# Altium schematic sheet 50_Gestión_Alimentación.SchDoc
size A4; SheetNumber: 4; SheetTotal: 11
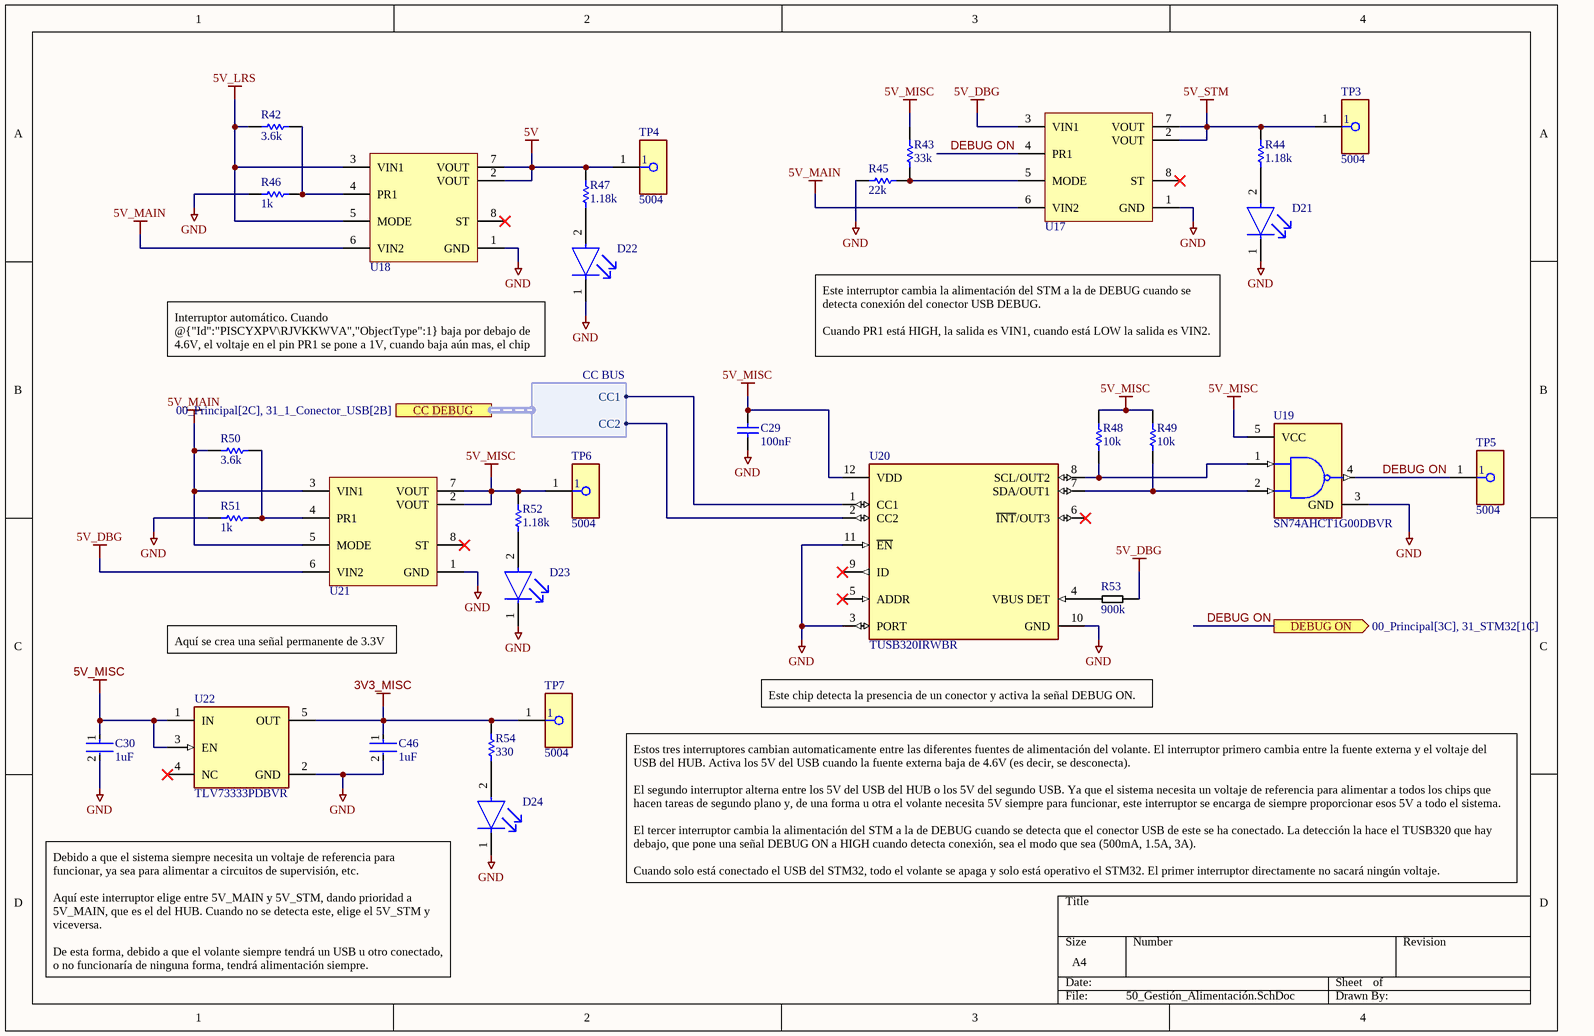
[diagram p0: 50_Gestión_Alimentación.SchDoc]

## Parts
C29  100nF  [CAPC1005X55X25NL05T05]
C30  1uF  [FP-C0402C-BB-IPC_B]
C46  1uF  [FP-C0402C-BB-IPC_B]
D21  APHD1608LZGCK  [FP-APHD1608LZGCK-MFG]  (value not drawn)
D22  APHD1608LZGCK  [FP-APHD1608LZGCK-MFG]  (value not drawn)
D23  APHD1608LZGCK  [FP-APHD1608LZGCK-MFG]  (value not drawn)
D24  APHD1608LZGCK  [FP-APHD1608LZGCK-MFG]  (value not drawn)
R42  3.6k  [RESC1005X40X25ML10T10]
R43  33k  [RESC1005X40X25NL10T10]
R44  1.18k  [RESC1005X40X25NL05T05]
R45  22k  [RESC1005X40X25NL10T10]
R46  1k  [RESC1005X40X25NL05T05]
R47  1.18k  [RESC1005X40X25NL05T05]
R48  10k  [RESC1005X40X25ML05T05]
R49  10k  [RESC1005X40X25ML05T05]
R50  3.6k  [RESC1005X40X25ML10T10]
R51  1k  [RESC1005X40X25NL05T05]
R52  1.18k  [RESC1005X40X25NL05T05]
R53  900k  [RES 1206]
R54  330  [RESC1005X40X25NL10T10]
TP3  5004  [FP-5004-MFG]
TP4  5004  [FP-5004-MFG]
TP5  5004  [FP-5004-MFG]
TP6  5004  [FP-5004-MFG]
TP7  5004  [FP-5004-MFG]
U17  TPS2117DRLR  [TPS2117DRLR]  (value not drawn)
U18  TPS2117DRLR  [TPS2117DRLR]  (value not drawn)
U19  SN74AHCT1G00DBVR  [FP-DBV0005A-IPC_A]
U20  TUSB320IRWBR  [FP-RWB0012A-MFG]
U21  TPS2117DRLR  [TPS2117DRLR]  (value not drawn)
U22  TLV73333PDBVR  [FP-DBV0005A-MFG]

## Ports
CC DEBUG (harness CC BUS, see 00_Principal[2C], 31_1_Conector_USB[2B]), DEBUG ON (out, see 00_Principal[3C], 31_STM32[1C])

## Harnesses
CC BUS: CC1, CC2

## Nets
3V3_MISC: C46.1 R54.2 TP7.1 U22.5(OUT)
5V: R47.2 TP4.1 U18.2(VOUT) U18.7(VOUT)
5V_DBG: R53.1 U17.3(VIN1) U21.6(VIN2)
5V_LRS: R42.1 U18.3(VIN1) U18.5(MODE)
5V_MAIN: R50.1 U17.6(VIN2) U18.6(VIN2) U21.3(VIN1) U21.5(MODE)
5V_MISC: C29.2 C30.1 R43.2 R48.2 R49.2 R52.2 TP6.1 U19.5(VCC) U20.12(VDD) U21.2(VOUT) U21.7(VOUT) U22.1(IN) U22.3(EN)
5V_STM: R44.2 TP3.1 U17.2(VOUT) U17.7(VOUT)
GND: C29.1 C30.2 C46.2 D21.1(C) D22.1(C) D23.1(C) D24.1(C) R45.1 R46.1 R51.1 U17.1(GND) U18.1(GND) U19.3(GND) U20.3(PORT) U20.10(GND) U20.11(~{EN}) U21.1(GND) U22.2(GND)
DEBUG ON: TP5.1 U17.4(PR1) U19.4(Y) ; port DEBUG ON
NetD21_2: D21.2(A) R44.1
NetD22_2: D22.2(A) R47.1
NetD23_2: D23.2(A) R52.1
NetD24_2: D24.2(A) R54.1
NetR42_2: R42.2 R46.2 U18.4(PR1)
NetR43_1: R43.1 R45.2 U17.5(MODE)
NetR48_1: R48.1 U19.1(A) U20.8(SCL/OUT2)
NetR49_1: R49.1 U19.2(B) U20.7(SDA/OUT1)
NetR50_2: R50.2 R51.2 U21.4(PR1)
NetR53_2: R53.2 U20.4(VBUS_DET)
NetU20_1: U20.1(CC1) ; port CC DEBUG.CC1
NetU20_2: U20.2(CC2) ; port CC DEBUG.CC2

Not connected (* = marked no-connect by the designer): U17 8(ST)*; U18 8(ST)*; U20 5(ADDR)* 6(~{INT}/OUT3)* 9(ID)*; U21 8(ST)*; U22 4(NC)*

## Notes on the sheet
- Interruptor automático. Cuando @{"Id":"PISCYXPV\RJVKKWVA","ObjectType":1} baja por debajo de 4.6V, el voltaje en el pin PR1 se pone a 1V, cuando baja aún mas, el chip cambia la salida a VIN2 y no usa 5V_LRS para ello.
- Este interruptor cambia la alimentación del STM a la de DEBUG cuando se detecta conexión del conector USB DEBUG.
  Cuando PR1 está HIGH, la salida es VIN1, cuando está LOW la salida es VIN2.
- Aquí se crea una señal permanente de 3.3V
- Este chip detecta la presencia de un conector y activa la señal DEBUG ON.
- Estos tres interruptores cambian automaticamente entre las diferentes fuentes de alimentación del volante. El interruptor primero cambia entre la fuente externa y el voltaje del USB del HUB. Activa los 5V del USB cuando la fuente externa baja de 4.6V (es decir, se desconecta).
  El segundo interruptor alterna entre los 5V del USB del HUB o los 5V del segundo USB. Ya que el sistema necesita un voltaje de referencia para alimentar a todos los chips que hacen tareas de segundo plano y, de una forma u otra el volante necesita 5V siempre para funcionar, este interruptor se encarga de siempre proporcionar esos 5V a todo el sistema.
  El tercer interruptor cambia la alimentación del STM a la de DEBUG cuando se detecta que el conector USB de este se ha conectado. La detección la hace el TUSB320 que hay debajo, que pone una señal DEBUG ON a HIGH cuando detecta conexión, sea el modo que sea (500mA, 1.5A, 3A).
  Cuando solo está conectado el USB del STM32, todo el volante se apaga y solo está operativo el STM32. El primer interruptor directamente no sacará ningún voltaje.
- Debido a que el sistema siempre necesita un voltaje de referencia para funcionar, ya sea para alimentar a circuitos de supervisión, etc.
  Aquí este interruptor elige entre 5V_MAIN y 5V_STM, dando prioridad a 5V_MAIN, que es el del HUB. Cuando no se detecta este, elige el 5V_STM y viceversa.
  De esta forma, debido a que el volante siempre tendrá un USB u otro conectado, o no funcionaría de ninguna forma, tendrá alimentación siempre.

## Library data of the parts
C29 = CMP-2008-02030-1: Manufacturer: Vitramon; Part Number: VJ0402Y104KXJCW1BC
C30 C46 = CMP-03020-034679-1: CAP CER 1UF 16V X5R 0402; Dielectric Material: Ceramic; Tolerance: 10%; RoHS Compliant: Yes; Voltage Rating (DC): 16V; Voltage Rating: 16V; Max Operating Temperature: 85°C; Packaging: Cut Tape; Width: 0.02inch; Dielectric: X5R; Lead Free: Lead Free; Min Operating Temperature: -55°C; Mount: Surface Mount; Case/Package: 0402; Thickness: 0.022inch; REACH SVHC: No SVHC; Length: 0.039inch; Case Code (Metric): 1005; Case Code (Imperial): 0402; Capacitance: 1uF
D21-D24 = CMP-44529-000045-1: LED GREEN CLEAR 1608 SMD; Test Current: 2mA; Dominant Wavelength: 525nm; Lens Color: Colorless; Luminous Intensity: 180mcd; Viewing Angle: 100°; Forward Voltage: 2.65V; Lens Size: 0.7mm; Lens Style: Round; Mount: Surface Mount; Packaging: Tape and Reel; Lens Transparency: Clear; Height: 0.75mm; Case/Package: 0603; Length: 1.6mm; Case Code (Metric): 1608; Width: 0.8mm; Color: Green; Case Code (Imperial): 0603
R42 R50 = CMP-2002-05802-1: Manufacturer: Panasonic; Part Number: ERA-2AEB362X
R43 = CMP-2002-05855-1: Part Number: ERA-2AED333X; Manufacturer: Panasonic
R44 R47 R52 = CMP-1011-00517-2: Part Number: ERJ-2RKF1181X; Manufacturer: Panasonic
R45 = CMP-2002-05849-1: Manufacturer: Panasonic; Part Number: ERA-2AED223X
R46 R51 = CMP-1011-00510-4: Chip Resistor, 1 KOhm, +/- 1%, 100 mW, -55 to 155 degC, 0402 (1005 Metric), RoHS, Tape and Reel; PartNumber: ERJ-2RKF1001X; Manufacturer: Basic Passives; Voltage Rating: 50 V; Case\/Package: 0402; Resistance: 1 KOhm; Power Rating: 100 mW; DatasheetVersion: 04/2015; Radiation Hardening: No; Pins: 2; Height: 0.35 mm; RoHSCompliant: true; Case Code (Imperial): 0402; ComponentLink2Description: Datasheet; ComponentLink1Description: Manufacturer URL; PackageReference: 0402; Mount: Surface Mount; Package Quantity: 10000; Tolerance: 1%; ComponentLink1URL: http://www.panasonic.com/; PackageDescription: 2-Pin Surface Mount Device, Body 1 x 0.5 mm; Mounting Technology: Surface Mount; Case Code (Metric): 1005; ComponentLink2URL: http://industrial.panasonic.com/cdbs/www-data/pdf/RDA0000/AOA0000C86.pdf; REACH SVHC: Yes; Packaging: Tape and Reel; Max Operating Temperature: 155 degC; Min Operating Temperature: -55 degC; Width: 0.5 mm; Length: 1 mm
R48 R49 = CMP-2002-00601-1: Manufacturer: Panasonic; Part Number: ERJ-2RHD1002X
R53 = RT1206CRE07900KL: 900k Resistor 200V 1206 0.5%; Supplier 1: DigiKey; Supplier Part Number 1: 13-RT1206CRE07900KLCT-ND
R54 = CMP-2002-05883-1: Manufacturer: Panasonic; Part Number: ERA2AEB331X
TP3-TP7 = CMP-2000-05575-2: PC TEST POINT MINIATURE YELLOW; Manufacturer: Keystone; Number Of Contacts: 1; Is Female: yes; Device Class L1: Connectors; Manufacturer Part Number: 5004; Digikey Description: PC TEST POINT MINIATURE YELLOW; ComponentLink2URL: https://www.keyelco.com/product-pdf.cfm?p=1313; Lead Free: Yes; ComponentLink2Description: Datasheet; Category: Conn; Height: 4.72mm; Octopart: https://octopart.com/5004-keystone-28591; Mouser Description: TEST POINT PC MINI .040"D YELLOW; Device Class L3: unset; Contact Material: Silver; Package: 5004; Automotive: No; Device Class L2: unset; RoHS: TRUE
U17 U18 U21 = TPS2117DRLR: Power Switch ICs - Power Distribution 1.6-V to 5.5-V 20-m ? 4-A low IQ power; Supplier 1: DigiKey; Supplier Part Number 1: 296-TPS2117DRLRCT-ND
U19 = CMP-0859-00141-4: IC GATE NAND 1CH 2-INP SOT23-5; Output Current: 8mA; Max Supply Voltage: 5.5V; High Level Output Current: -8mA; Number of Circuits: 1; Schmitt Trigger Input: No; Propagation Delay: 7.9ns; Logic Function: NAND GATE; Min Supply Voltage: 4.5V; Number of Input Lines: 2; Turn-On Delay Time: 9ns; Quiescent Current: 1uA; Length: 2.9mm; Number of Pins: 5; Lead Free: Lead Free; Height: 1.15mm; Case/Package: SOT-23; Termination: SMD/SMT; Packaging: Tape and Reel; Number of Bits: 1; Number of Elements: 1; REACH SVHC: No SVHC; Low Level Output Current: 8mA; Number of Output Lines: 1; Weight: 0.000557oz; Mount: Surface Mount; Max Output Current: 8mA; Max Operating Temperature: 125°C; Contact Plating: Tin; Package Quantity: 1; Min Operating Temperature: -40°C; Number of Outputs: 1; Width: 1.6mm; Radiation Hardening: No; Number of Inputs: 2; Number of Gates: 1
U20 = CMP-04877-000006-1: IC INTERFACE SPECIALIZED 12X2QFN; Number of Ports: 1; Max Supply Voltage: 5V; USB Standard: USB 1.1; Interface: I2C; Min Supply Voltage: 2.7V; ESD Protection: Yes; Data Rate: 480Mbps; REACH SVHC: No SVHC; Mount: Surface Mount; Min Operating Temperature: -40°C; Case/Package: TQFP; Lead Free: Lead Free; Length: 1.65mm; Contact Plating: Gold; Height: 0.4mm; Max Operating Temperature: 85°C; Number of Pins: 12; Packaging: Tape and Reel; RoHS Compliant: Yes; Width: 1.65mm
U22 = CMP-04917-000053-1: IC REG LINEAR 3.3V 300MA SOT23-5; Manufacturer: Texas Instruments; Max Junction Temp: +125°C; Accuracy Percentage: 1%; Min Supply Voltage: 1.4V; Number Of Outputs: 1; Dropout Voltage: 125mV; Nominal Supply Current: 34uA; Max Supply Voltage: 5.5V; Output Type: Fixed; Standoff Height: 0mm; Digikey Description: IC REG LINEAR 3.3V 300MA SOT23-5; Manufacturer Part Number: TLV73333PDBVR; Temperature Range High: +125°C; Temperature: -40°C to +125°C; Output Current: 300mA; Mouser Description: LDO Voltage Regulators Capacitr-Free 300-mA 5-SOT-23 -40 to 125; Automotive: No; Height: 1.45mm; Device Class L3: Voltage Regulators - Linear; ComponentLink2Description: Datasheet; Device Class L1: Integrated Circuits (ICs); ComponentLink2URL: http://www.ti.com/lit/ds/symlink/tlv733p.pdf; Octopart: https://octopart.com/tlv73333pdbvr-texas+instruments-51080890; Temperature Range Low: -40°C; RoHS: TRUE; Lead Free: Yes; Output Voltage: 3.3V; Package: DBV0005A; Device Class L2: Power Management ICs; Category: IC